# EAGLE design Crossover_HP (EAGLE 7.5.0)
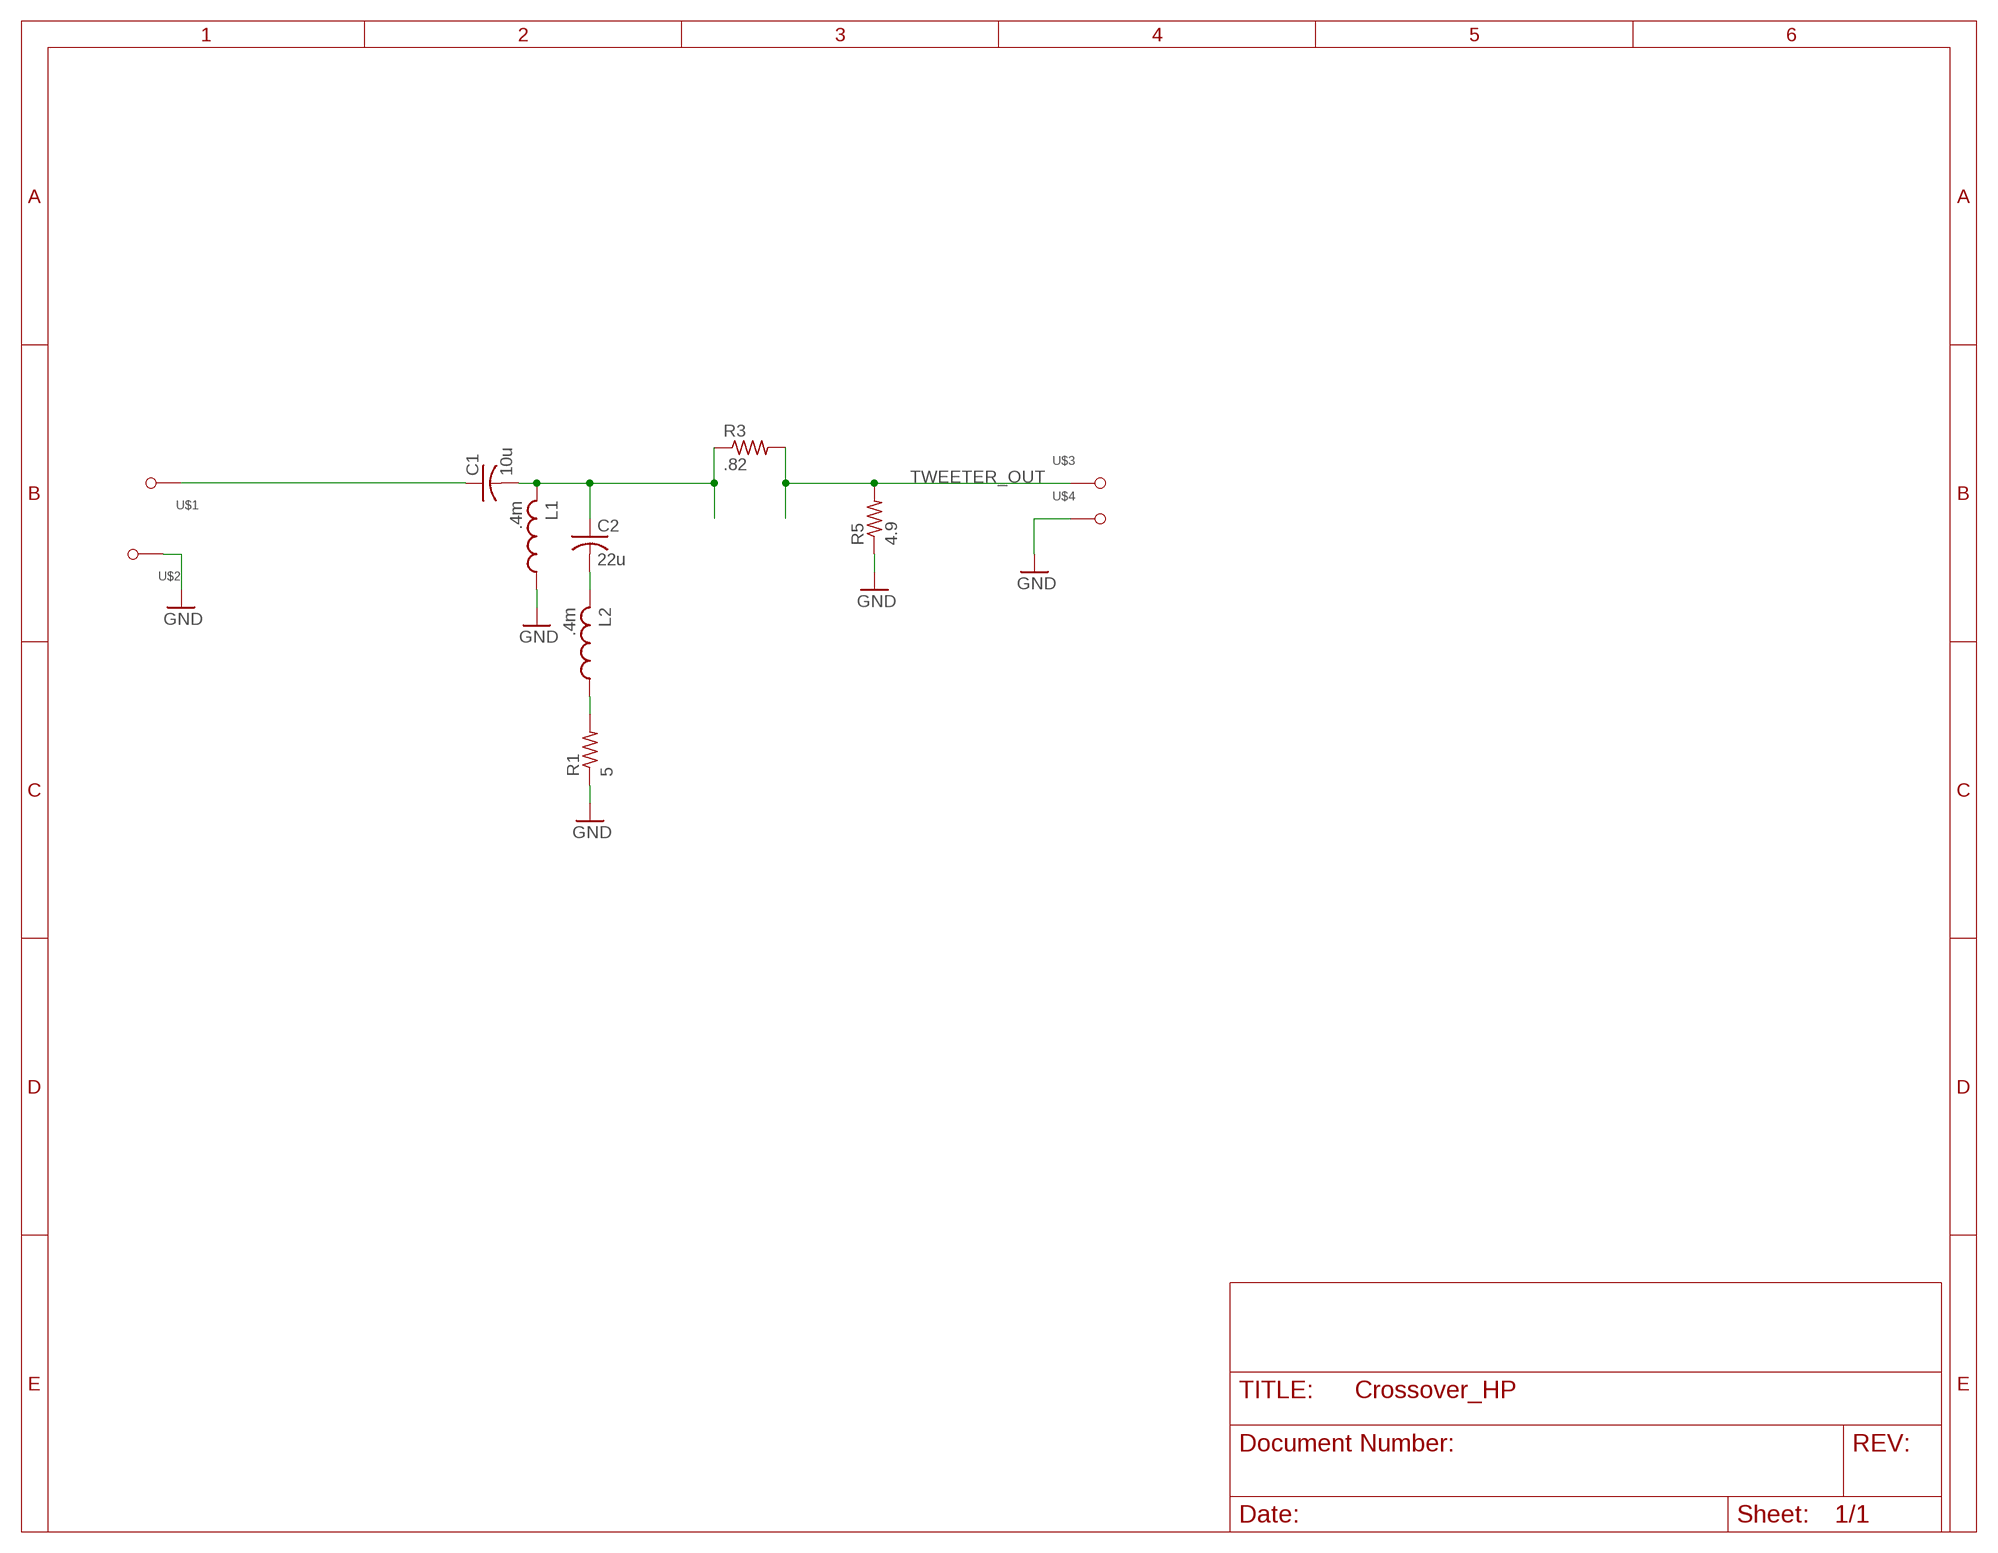
[diagram p0: schematic, sheet 1]

## Parts
C1  10u  C-USC3.5MMP_8MMD  [3.5MMP_8MMP]
C2  22u  C-USC5MMP_10MMD  [5MMP_10MMD]
L1  .4m  L-US  [AIR_COIL_2INX3/4IN]
L2  .4m  L-US  [AIR_COIL_2INX3/4IN]
R1  5  R-US_5W  [9.5MMX9MMX22MM]
R3  .82  R-US_10W  [9.5MMX9MMX48MM]
R5  4.9  R-US_10W  [9.5MMX9MMX48MM]
U$1  18AWG_HOLE  [18AWG_HOLE]
U$2  18AWG_HOLE  [18AWG_HOLE]
U$3  18AWG_HOLE  [18AWG_HOLE]
U$4  18AWG_HOLE  [18AWG_HOLE]

## Nets
GND: L1.P$1 R1.P$1 R5.P$1 U$2.P$1(>NAME) U$4.P$1(>NAME)
N$2: C1.NEG C2.POS L1.P$2 R3.P$1
N$4: C2.NEG L2.P$2
N$5: L2.P$1 R1.P$2
N$6: C1.POS U$1.P$1(>NAME)
TWEETER_OUT: R3.P$2 R5.P$2 U$3.P$1(>NAME)

## Library data of the parts
C1 C2 = rcl:C-US: CAPACITOR, American symbol
L1 L2 = rcl:L-US: INDUCTOR, American symbol
R1 R3 R5 = rcl:R-US_: RESISTOR, American symbol
U$1-U$4 = Amplifier_Parts:18AWG_HOLE

## Board
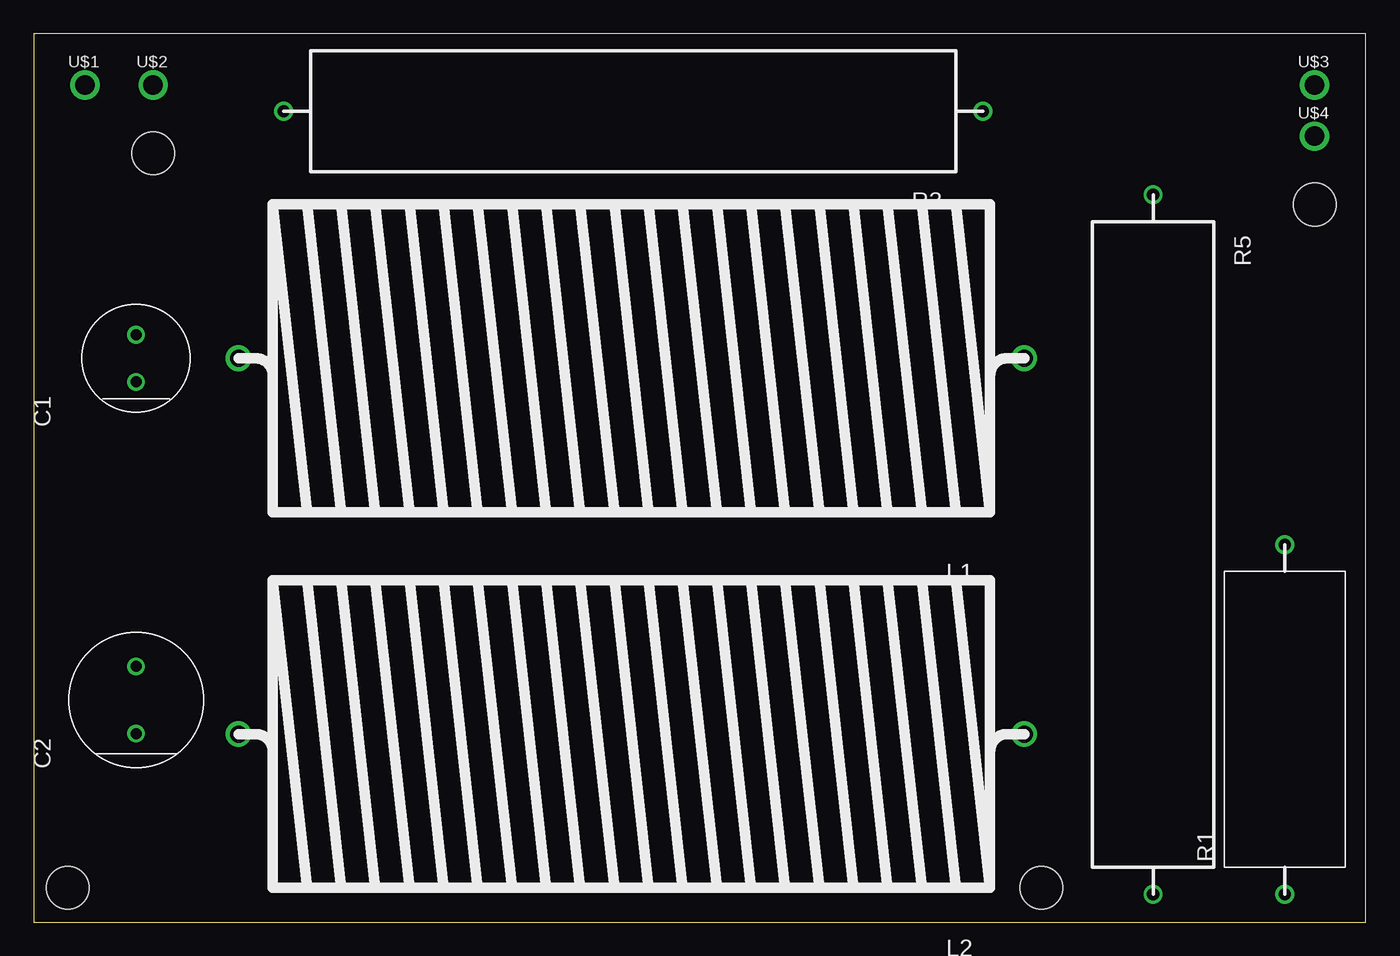
[diagram p1: board, top side]
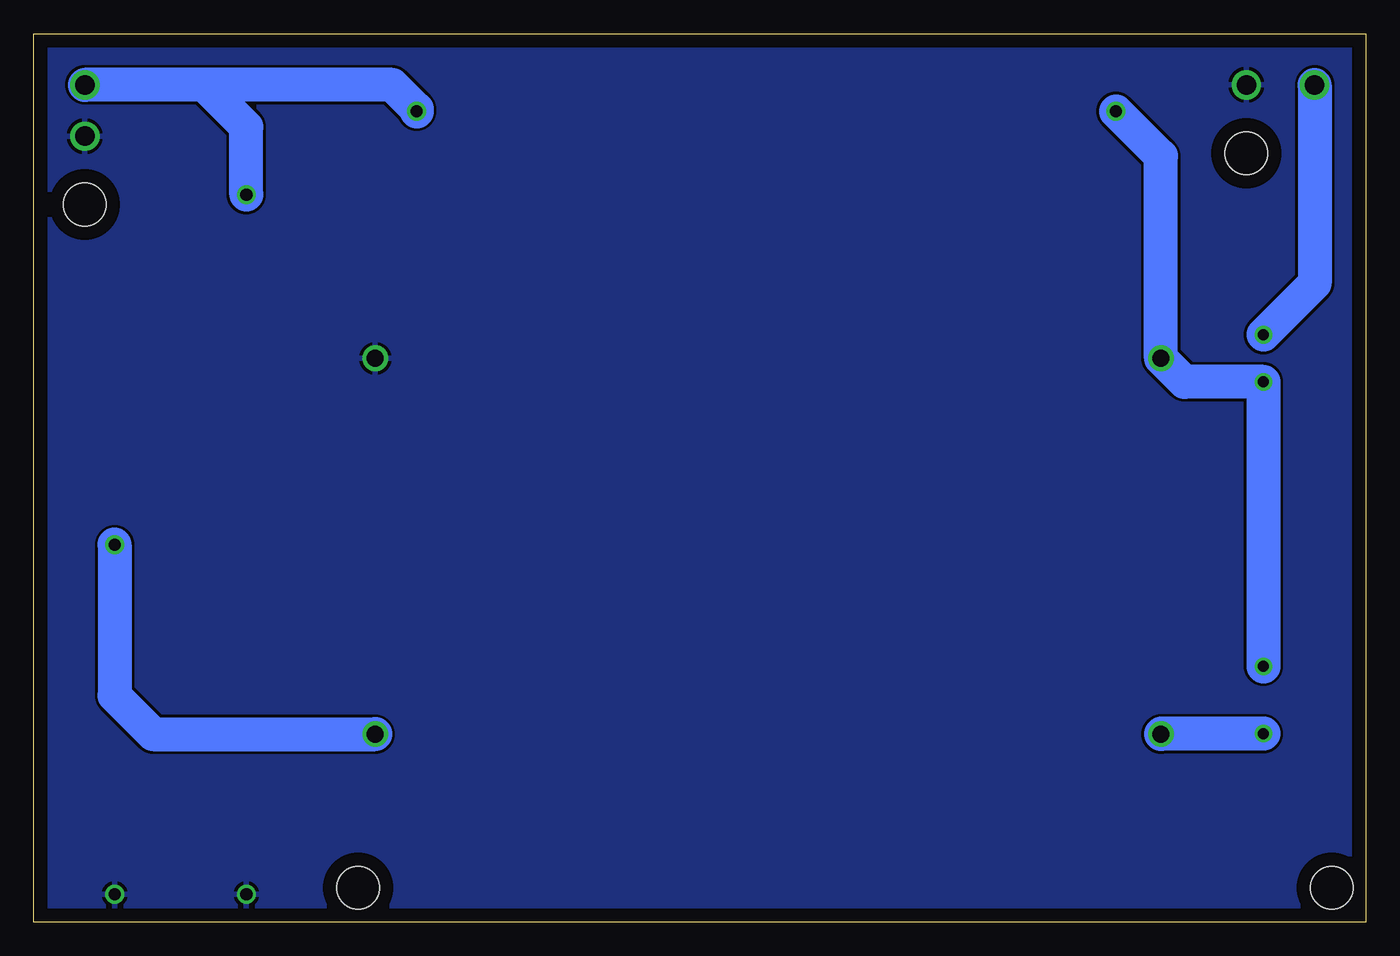
[diagram p2: board, bottom side, seen from below]

Size 99.06 x 66.04 mm. Coordinates in mm from the lower left corner, seen from the top.
Outline: 0,0 99.06,0 99.06,66.04 0,66.04 0,0
Copper layers (1*16): Top 0.035mm / dielectric 1.5mm / Bottom 0.035mm
Design rules "default": minimum track width 10mil, minimum drill 24mil, track to track 8mil, track to pad 8mil, pad to pad 8mil, via to via 8mil, smd to smd 8mil, copper to edge 40mil, drill to drill 8mil, minimum pad ring 10mil, minimum via ring 8mil, stop-mask expansion 4mil, vias tented up to drill 0mil, thermal gap 10mil
Holes 3.17 mm at 2.54,2.54 8.89,57.15 95.25,53.34 74.93,2.54

### Footprints (pad centres in the part's own frame; a part is rotated, then mirrored left to right if it is on the bottom)
3.5MMP_8MMP = drill 0.8: NEG -1.75,0; POS 1.75,0
5MMP_10MMD = drill 0.8: NEG -2.5,0; POS 2.5,0
AIR_COIL_2INX3/4IN = drill 1.27: P$1 -2.54,11.43; P$2 55.88,11.43
9.5MMX9MMX22MM = drill 0.9: P$1 -2,4.5; P$2 24,4.5
9.5MMX9MMX48MM = drill 0.9: P$1 50,4.5; P$2 -2,4.5
18AWG_HOLE = drill 1.448: P$1 0,0

### Placement (x,y rotation side)
C1  7.62,41.91 90 top
C2  7.62,16.51 90 top
L1  71.12,53.34 180 top
L2  71.12,25.4 180 top
R1  97.54,4.06 90 top
R3  68.58,64.77 180 top
R5  78.74,52.07 270 top
U$1  3.81,62.23 0 top
U$2  8.89,62.23 0 top
U$3  95.25,62.23 0 top
U$4  95.25,58.42 0 top

### Tracks (layer width: path | path; a pad name or v marks a point on that pad's centre or on a via)
GND
  pour Bottom: 0,0 99.06,0 99.06,66.04 0,66.04
N$2
  Bottom 2.54: C2.POS C1.NEG 13.49,40.16 L1.P$2 15.24,56.93 R3.P$1
N$4
  Bottom 2.54: C2.NEG 15.2,14.01 L2.P$2
N$5
  Bottom 2.54: R1.P$2 93.04,16.84 90.17,13.97 L2.P$1
N$6
  Bottom 2.54: U$1.P$1 3.81,47.47 C1.POS
TWEETER_OUT
  Bottom 2.54: R3.P$2 70.58,60.42 72.39,62.23 86.36,62.23 | 86.36,62.23 U$3.P$1 | R5.P$2 83.24,59.11 86.36,62.23